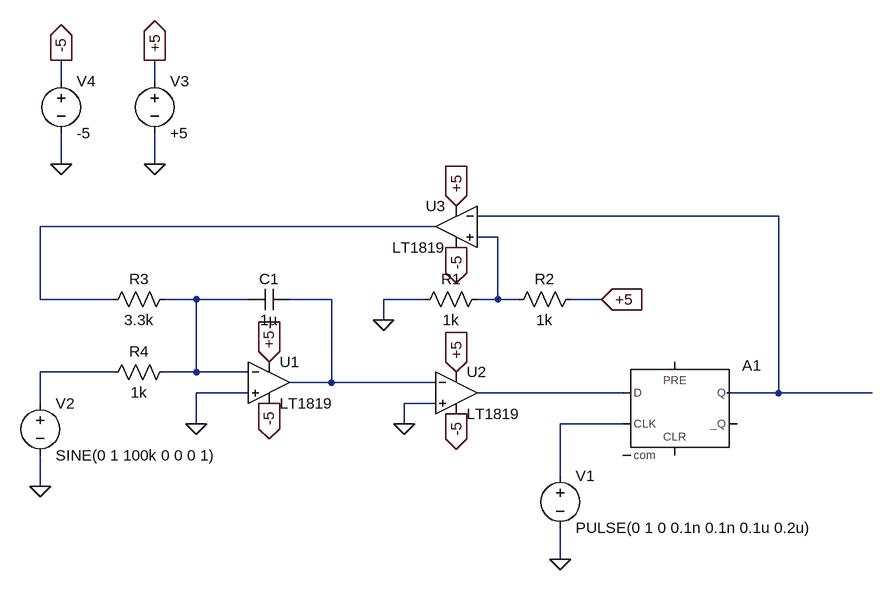
[diagram p0: schematic Delta Sigma ADC.asc]
Delta Sigma ADC.asc, the LTspice schematic file:
Version 4
SHEET 1 1108 680
WIRE -144 -128 -144 -160
WIRE 0 -128 0 -160
WIRE -144 0 -144 -48
WIRE 0 0 0 -48
WIRE 960 80 496 80
WIRE 432 96 -176 96
WIRE 528 112 496 112
WIRE -176 208 -176 96
WIRE -64 208 -176 208
WIRE 64 208 16 208
WIRE 144 208 64 208
WIRE 272 208 208 208
WIRE 416 208 352 208
WIRE 528 208 528 112
WIRE 528 208 496 208
WIRE 560 208 528 208
WIRE 688 208 640 208
WIRE 352 240 352 208
WIRE -64 320 -176 320
WIRE 64 320 64 208
WIRE 64 320 16 320
WIRE 144 320 64 320
WIRE 272 336 272 208
WIRE 272 336 208 336
WIRE 432 336 272 336
WIRE 144 352 64 352
WIRE 720 352 496 352
WIRE 960 352 960 80
WIRE 960 352 880 352
WIRE 1104 352 960 352
WIRE -176 368 -176 320
WIRE 432 368 384 368
WIRE 64 400 64 352
WIRE 384 400 384 368
WIRE 720 400 624 400
WIRE 624 480 624 400
WIRE -176 496 -176 448
WIRE 624 608 624 560
FLAG 176 304 +5
IOPIN 176 304 In
FLAG 464 320 +5
IOPIN 464 320 In
FLAG 464 64 +5
IOPIN 464 64 In
FLAG 176 368 -5
IOPIN 176 368 Out
FLAG 464 384 -5
IOPIN 464 384 Out
FLAG 464 128 -5
IOPIN 464 128 Out
FLAG 688 208 +5
IOPIN 688 208 In
FLAG 352 240 0
FLAG 64 400 0
FLAG 384 400 0
FLAG 624 608 0
FLAG -176 496 0
FLAG 0 -160 +5
IOPIN 0 -160 Out
FLAG 0 0 0
FLAG -144 -160 -5
IOPIN -144 -160 Out
FLAG -144 0 0
SYMBOL Opamps\\LT1819 176 336 R0
SYMATTR InstName U1
SYMBOL Opamps\\LT1819 464 352 R0
SYMATTR InstName U2
SYMBOL Opamps\\LT1819 464 96 M0
SYMATTR InstName U3
SYMBOL res 512 192 R90
WINDOW 0 0 56 VBottom 2
WINDOW 3 32 56 VTop 2
SYMATTR InstName R1
SYMATTR Value 1k
SYMBOL res 656 192 R90
WINDOW 0 0 56 VBottom 2
WINDOW 3 32 56 VTop 2
SYMATTR InstName R2
SYMATTR Value 1k
SYMBOL cap 208 192 R90
WINDOW 0 0 32 VBottom 2
WINDOW 3 32 32 VTop 2
SYMATTR InstName C1
SYMATTR Value 1µ
SYMBOL res 32 192 R90
WINDOW 0 0 56 VBottom 2
WINDOW 3 32 56 VTop 2
SYMATTR InstName R3
SYMATTR Value 3.3k
SYMBOL res 32 304 R90
WINDOW 0 0 56 VBottom 2
WINDOW 3 32 56 VTop 2
SYMATTR InstName R4
SYMATTR Value 1k
SYMBOL Digital\\dflop 800 304 R0
SYMATTR InstName A1
SYMBOL voltage 624 464 R0
WINDOW 123 0 0 Left 0
WINDOW 39 0 0 Left 0
SYMATTR InstName V1
SYMATTR Value PULSE(0 1 0 0.1n 0.1n 0.1u 0.2u)
SYMBOL voltage -176 352 R0
WINDOW 123 0 0 Left 0
WINDOW 39 0 0 Left 0
SYMATTR InstName V2
SYMATTR Value SINE(0 1 100k 0 0 0 1)
SYMBOL voltage 0 -144 R0
WINDOW 123 0 0 Left 0
WINDOW 39 0 0 Left 0
SYMATTR InstName V3
SYMATTR Value +5
SYMBOL voltage -144 -144 R0
WINDOW 123 0 0 Left 0
WINDOW 39 0 0 Left 0
SYMATTR InstName V4
SYMATTR Value -5

The netlist it stands for:
* Delta Sigma ADC.asc
* U1: LT1819 (symbol Opamps\LT1819 not available, pins judged from their places): In+=0 In-=N004 V+=+5 V-=-5 OUT=N005
* U2: LT1819 (symbol Opamps\LT1819 not available, pins judged from their places): In+=0 In-=N005 V+=+5 V-=-5 OUT=N007
* U3: LT1819 (symbol Opamps\LT1819 not available, pins judged from their places): In+=N003 In-=N001 V+=+5 V-=-5 OUT=N002
R1 N003 0 1k
R2 +5 N003 1k
C1 N005 N004 1µ
R3 N004 N002 3.3k
R4 N004 N006 1k
A1 N007 0 N008 0 0 0 N001 0 DFLOP
V1 N008 0 PULSE(0 1 0 0.1n 0.1n 0.1u 0.2u)
V2 N006 0 SINE(0 1 100k 0 0 0 1)
V3 +5 0 +5
V4 -5 0 -5
.backanno
.end